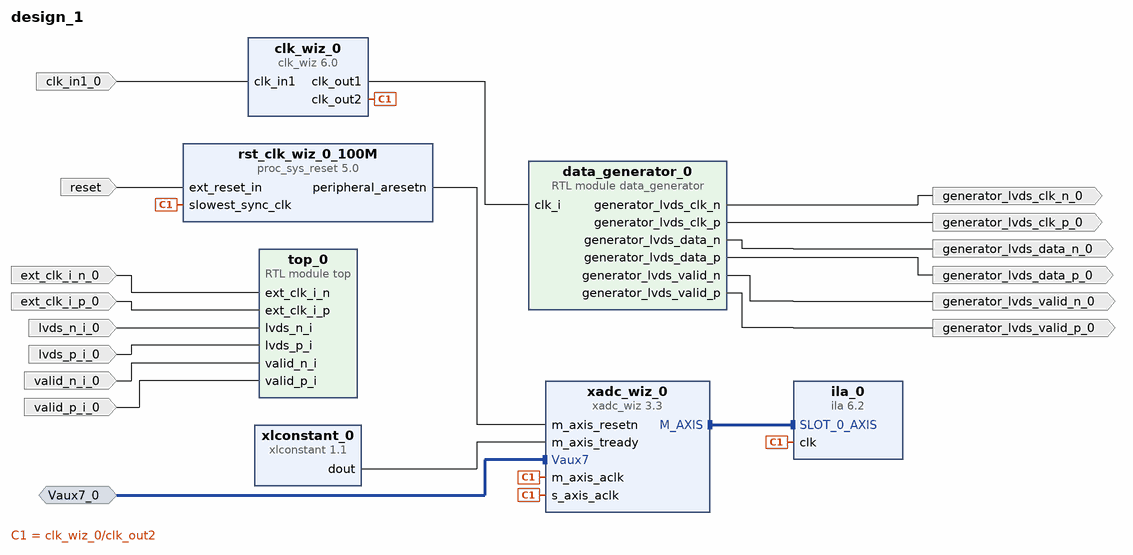
[diagram p0: block diagram of the top level]
# Vivado block design design_1, xc7a35tcpg236-1, Vivado 2024.1.2
create_bd_design design_1

create_bd_intf_port -mode Slave -vlnv xilinx.com:interface:diff_analog_io_rtl:1.0 Vaux7_0
create_bd_port -dir I ext_clk_i_n_0
create_bd_port -dir I ext_clk_i_p_0
create_bd_port -dir I lvds_n_i_0
create_bd_port -dir I lvds_p_i_0
create_bd_port -dir I valid_n_i_0
create_bd_port -dir I valid_p_i_0
create_bd_port -dir O -type clk generator_lvds_clk_n_0
create_bd_port -dir O -type clk generator_lvds_clk_p_0
create_bd_port -dir O generator_lvds_data_n_0
create_bd_port -dir O generator_lvds_data_p_0
create_bd_port -dir O generator_lvds_valid_n_0
create_bd_port -dir O generator_lvds_valid_p_0
create_bd_port -dir I -type clk clk_in1_0
create_bd_port -dir I -type rst reset
set_property -dict {CONFIG.POLARITY ACTIVE_HIGH} [get_bd_ports reset]

create_bd_cell -type module -reference data_generator data_generator_0
create_bd_cell -type ip -vlnv xilinx.com:ip:clk_wiz:6.0 clk_wiz_0
set_property -dict [list \
  CONFIG.CLKOUT1_JITTER 170.699 \
  CONFIG.CLKOUT1_PHASE_ERROR 105.461 \
  CONFIG.CLKOUT1_REQUESTED_OUT_FREQ 36 \
  CONFIG.CLKOUT2_JITTER 137.681 \
  CONFIG.CLKOUT2_PHASE_ERROR 105.461 \
  CONFIG.CLKOUT2_USED true \
  CONFIG.MMCM_CLKFBOUT_MULT_F 9.000 \
  CONFIG.MMCM_CLKOUT0_DIVIDE_F 25.000 \
  CONFIG.MMCM_CLKOUT1_DIVIDE 9 \
  CONFIG.MMCM_DIVCLK_DIVIDE 1 \
  CONFIG.NUM_OUT_CLKS 2 \
  CONFIG.USE_LOCKED false \
  CONFIG.USE_RESET false \
] [get_bd_cells clk_wiz_0]
create_bd_cell -type module -reference top top_0
create_bd_cell -type ip -vlnv xilinx.com:ip:xadc_wiz:3.3 xadc_wiz_0
set_property -dict [list \
  CONFIG.CHANNEL_ENABLE_VAUXP12_VAUXN12 false \
  CONFIG.CHANNEL_ENABLE_VAUXP13_VAUXN13 false \
  CONFIG.CHANNEL_ENABLE_VAUXP14_VAUXN14 false \
  CONFIG.CHANNEL_ENABLE_VAUXP15_VAUXN15 false \
  CONFIG.CHANNEL_ENABLE_VAUXP4_VAUXN4 false \
  CONFIG.CHANNEL_ENABLE_VAUXP5_VAUXN5 false \
  CONFIG.CHANNEL_ENABLE_VAUXP6_VAUXN6 false \
  CONFIG.CHANNEL_ENABLE_VAUXP7_VAUXN7 false \
  CONFIG.CHANNEL_ENABLE_VP_VN false \
  CONFIG.ENABLE_AXI4STREAM true \
  CONFIG.ENABLE_DCLK true \
  CONFIG.ENABLE_DRP false \
  CONFIG.ENABLE_RESET false \
  CONFIG.EXTERNAL_MUX_CHANNEL VP_VN \
  CONFIG.FIFO_DEPTH 512 \
  CONFIG.INTERFACE_SELECTION None \
  CONFIG.OT_ALARM false \
  CONFIG.SEQUENCER_MODE Off \
  CONFIG.SINGLE_CHANNEL_SELECTION VAUXP7_VAUXN7 \
  CONFIG.USER_TEMP_ALARM false \
  CONFIG.VCCAUX_ALARM false \
  CONFIG.VCCINT_ALARM false \
  CONFIG.XADC_STARUP_SELECTION single_channel \
] [get_bd_cells xadc_wiz_0]
create_bd_cell -type ip -vlnv xilinx.com:ip:ila:6.2 ila_0
set_property -dict {CONFIG.C_DATA_DEPTH 4096 CONFIG.C_INPUT_PIPE_STAGES 1 CONFIG.C_SLOT_0_AXI_PROTOCOL AXI4S} [get_bd_cells ila_0]
create_bd_cell -type ip -vlnv xilinx.com:ip:proc_sys_reset:5.0 rst_clk_wiz_0_100M
set_property -dict {CONFIG.RESET_BOARD_INTERFACE reset CONFIG.USE_BOARD_FLOW true} [get_bd_cells rst_clk_wiz_0_100M]
create_bd_cell -type ip -vlnv xilinx.com:ip:xlconstant:1.1 xlconstant_0

# ---- connections ----

connect_bd_intf_net -intf_net Vaux7_0_1 [get_bd_intf_ports Vaux7_0] [get_bd_intf_pins xadc_wiz_0/Vaux7]
connect_bd_intf_net [get_bd_intf_pins xadc_wiz_0/M_AXIS] [get_bd_intf_pins ila_0/SLOT_0_AXIS]
connect_bd_net -net clk_in1_0_1 [get_bd_ports clk_in1_0] [get_bd_pins clk_wiz_0/clk_in1]
connect_bd_net [get_bd_pins clk_wiz_0/clk_out1] [get_bd_pins data_generator_0/clk_i]
connect_bd_net [get_bd_pins clk_wiz_0/clk_out2] \
  [get_bd_pins xadc_wiz_0/s_axis_aclk] [get_bd_pins ila_0/clk] [get_bd_pins xadc_wiz_0/m_axis_aclk] \
  [get_bd_pins rst_clk_wiz_0_100M/slowest_sync_clk]
connect_bd_net [get_bd_pins data_generator_0/generator_lvds_clk_n] [get_bd_ports generator_lvds_clk_n_0]
connect_bd_net [get_bd_pins data_generator_0/generator_lvds_clk_p] [get_bd_ports generator_lvds_clk_p_0]
connect_bd_net [get_bd_pins data_generator_0/generator_lvds_data_n] [get_bd_ports generator_lvds_data_n_0]
connect_bd_net [get_bd_pins data_generator_0/generator_lvds_data_p] [get_bd_ports generator_lvds_data_p_0]
connect_bd_net [get_bd_pins data_generator_0/generator_lvds_valid_n] [get_bd_ports generator_lvds_valid_n_0]
connect_bd_net [get_bd_pins data_generator_0/generator_lvds_valid_p] [get_bd_ports generator_lvds_valid_p_0]
connect_bd_net -net ext_clk_i_n_0_1 [get_bd_ports ext_clk_i_n_0] [get_bd_pins top_0/ext_clk_i_n]
connect_bd_net -net ext_clk_i_p_0_1 [get_bd_ports ext_clk_i_p_0] [get_bd_pins top_0/ext_clk_i_p]
connect_bd_net -net lvds_n_i_0_1 [get_bd_ports lvds_n_i_0] [get_bd_pins top_0/lvds_n_i]
connect_bd_net -net lvds_p_i_0_1 [get_bd_ports lvds_p_i_0] [get_bd_pins top_0/lvds_p_i]
connect_bd_net [get_bd_ports reset] [get_bd_pins rst_clk_wiz_0_100M/ext_reset_in]
connect_bd_net [get_bd_pins rst_clk_wiz_0_100M/peripheral_aresetn] [get_bd_pins xadc_wiz_0/m_axis_resetn]
connect_bd_net -net valid_n_i_0_1 [get_bd_ports valid_n_i_0] [get_bd_pins top_0/valid_n_i]
connect_bd_net -net valid_p_i_0_1 [get_bd_ports valid_p_i_0] [get_bd_pins top_0/valid_p_i]
connect_bd_net [get_bd_pins xlconstant_0/dout] [get_bd_pins xadc_wiz_0/m_axis_tready]

validate_bd_design
save_bd_design
